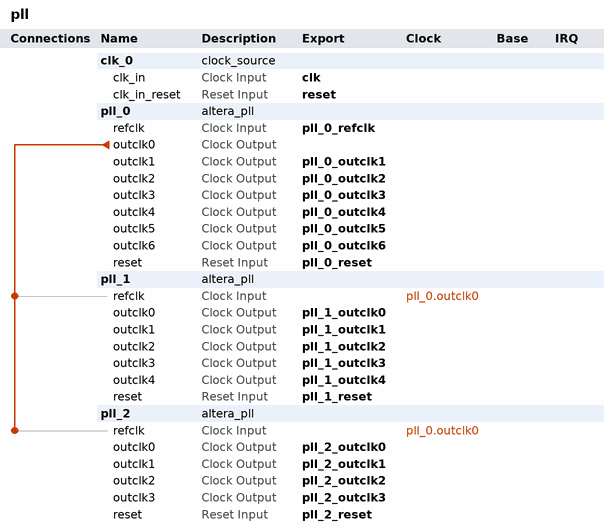
[diagram p0: system contents]
# Platform Designer (Qsys) system pll, Cyclone V 5CSEBA6U23I7
# Parameters at their usual value, and those the tool derives, are not listed.
package require -exact qsys 17.1
create_system pll
set_project_property DEVICE_FAMILY {Cyclone V}
set_project_property DEVICE 5CSEBA6U23I7

add_instance clk_0 clock_source 17.1
set_instance_parameter_value clk_0 clockFrequency 50000000

add_instance pll_0 altera_pll 17.1
set_instance_parameter_value pll_0 gui_actual_output_clock_frequency0 {120.000000 MHz}
set_instance_parameter_value pll_0 gui_actual_output_clock_frequency3 {32.533324 MHz}
set_instance_parameter_value pll_0 gui_device_speed_grade 2
set_instance_parameter_value pll_0 gui_number_of_clocks 8
set_instance_parameter_value pll_0 gui_operation_mode normal
set_instance_parameter_value pll_0 gui_output_clock_frequency0 256.0
set_instance_parameter_value pll_0 gui_output_clock_frequency1 112.0
set_instance_parameter_value pll_0 gui_output_clock_frequency2 64.0
set_instance_parameter_value pll_0 gui_output_clock_frequency3 32.0
set_instance_parameter_value pll_0 gui_pll_auto_reset On
set_instance_parameter_value pll_0 gui_pll_mode {Fractional-N PLL}
set_instance_parameter_value pll_0 gui_reference_clock_frequency 50.0
set_instance_parameter_value pll_0 gui_use_locked false

add_instance pll_1 altera_pll 17.1
set_instance_parameter_value pll_1 gui_device_speed_grade 2
set_instance_parameter_value pll_1 gui_number_of_clocks 5
set_instance_parameter_value pll_1 gui_operation_mode normal
set_instance_parameter_value pll_1 gui_output_clock_frequency0 56.75
set_instance_parameter_value pll_1 gui_output_clock_frequency1 28.375
set_instance_parameter_value pll_1 gui_output_clock_frequency2 14.1875
set_instance_parameter_value pll_1 gui_output_clock_frequency3 7.09375
set_instance_parameter_value pll_1 gui_pll_auto_reset On
set_instance_parameter_value pll_1 gui_pll_mode {Integer-N PLL}
set_instance_parameter_value pll_1 gui_reference_clock_frequency 256.0
set_instance_parameter_value pll_1 gui_use_locked false

add_instance pll_2 altera_pll 17.1
set_instance_parameter_value pll_2 gui_actual_output_clock_frequency0 {36.000000 MHz}
set_instance_parameter_value pll_2 gui_actual_output_clock_frequency1 {31.500000 MHz}
set_instance_parameter_value pll_2 gui_actual_output_clock_frequency2 {25.568627 MHz}
set_instance_parameter_value pll_2 gui_device_speed_grade 1
set_instance_parameter_value pll_2 gui_number_of_clocks 4
set_instance_parameter_value pll_2 gui_operation_mode normal
set_instance_parameter_value pll_2 gui_output_clock_frequency0 31.1
set_instance_parameter_value pll_2 gui_output_clock_frequency1 25.175
set_instance_parameter_value pll_2 gui_output_clock_frequency2 17.734475
set_instance_parameter_value pll_2 gui_output_clock_frequency3 8.867237
set_instance_parameter_value pll_2 gui_pll_auto_reset On
set_instance_parameter_value pll_2 gui_pll_mode {Fractional-N PLL}
set_instance_parameter_value pll_2 gui_ps_units2 degrees
set_instance_parameter_value pll_2 gui_reference_clock_frequency 256.0
set_instance_parameter_value pll_2 gui_use_locked false

# connections
add_connection pll_0.outclk0 pll_1.refclk clock
add_connection pll_0.outclk0 pll_2.refclk clock

# exported interfaces
add_interface clk clock sink
set_interface_property clk EXPORT_OF clk_0.clk_in
add_interface pll_0_outclk1 clock source
set_interface_property pll_0_outclk1 EXPORT_OF pll_0.outclk1
add_interface pll_0_outclk2 clock source
set_interface_property pll_0_outclk2 EXPORT_OF pll_0.outclk2
add_interface pll_0_outclk3 clock source
set_interface_property pll_0_outclk3 EXPORT_OF pll_0.outclk3
add_interface pll_0_outclk4 clock source
set_interface_property pll_0_outclk4 EXPORT_OF pll_0.outclk4
add_interface pll_0_outclk5 clock source
set_interface_property pll_0_outclk5 EXPORT_OF pll_0.outclk5
add_interface pll_0_outclk6 clock source
set_interface_property pll_0_outclk6 EXPORT_OF pll_0.outclk6
add_interface pll_0_refclk clock sink
set_interface_property pll_0_refclk EXPORT_OF pll_0.refclk
add_interface pll_0_reset reset sink
set_interface_property pll_0_reset EXPORT_OF pll_0.reset
add_interface pll_1_outclk0 clock source
set_interface_property pll_1_outclk0 EXPORT_OF pll_1.outclk0
add_interface pll_1_outclk1 clock source
set_interface_property pll_1_outclk1 EXPORT_OF pll_1.outclk1
add_interface pll_1_outclk2 clock source
set_interface_property pll_1_outclk2 EXPORT_OF pll_1.outclk2
add_interface pll_1_outclk3 clock source
set_interface_property pll_1_outclk3 EXPORT_OF pll_1.outclk3
add_interface pll_1_outclk4 clock source
set_interface_property pll_1_outclk4 EXPORT_OF pll_1.outclk4
add_interface pll_1_reset reset sink
set_interface_property pll_1_reset EXPORT_OF pll_1.reset
add_interface pll_2_outclk0 clock source
set_interface_property pll_2_outclk0 EXPORT_OF pll_2.outclk0
add_interface pll_2_outclk1 clock source
set_interface_property pll_2_outclk1 EXPORT_OF pll_2.outclk1
add_interface pll_2_outclk2 clock source
set_interface_property pll_2_outclk2 EXPORT_OF pll_2.outclk2
add_interface pll_2_outclk3 clock source
set_interface_property pll_2_outclk3 EXPORT_OF pll_2.outclk3
add_interface pll_2_reset reset sink
set_interface_property pll_2_reset EXPORT_OF pll_2.reset
add_interface reset reset sink
set_interface_property reset EXPORT_OF clk_0.clk_in_reset

set_interconnect_requirement {$system} qsys_mm.clockCrossingAdapter HANDSHAKE
set_interconnect_requirement {$system} qsys_mm.enableEccProtection FALSE
set_interconnect_requirement {$system} qsys_mm.insertDefaultSlave FALSE
set_interconnect_requirement {$system} qsys_mm.maxAdditionalLatency 1

save_system pll.qsys
